# Altium schematic sheet Display.SchDoc: Display
size A4; DrawnBy: Mauro De Bruyn; Revision: 1; SheetNumber: 1; SheetTotal: 5; Sheet 1: 1; Sheet of: 4; Number: PXL Project soldeerbout
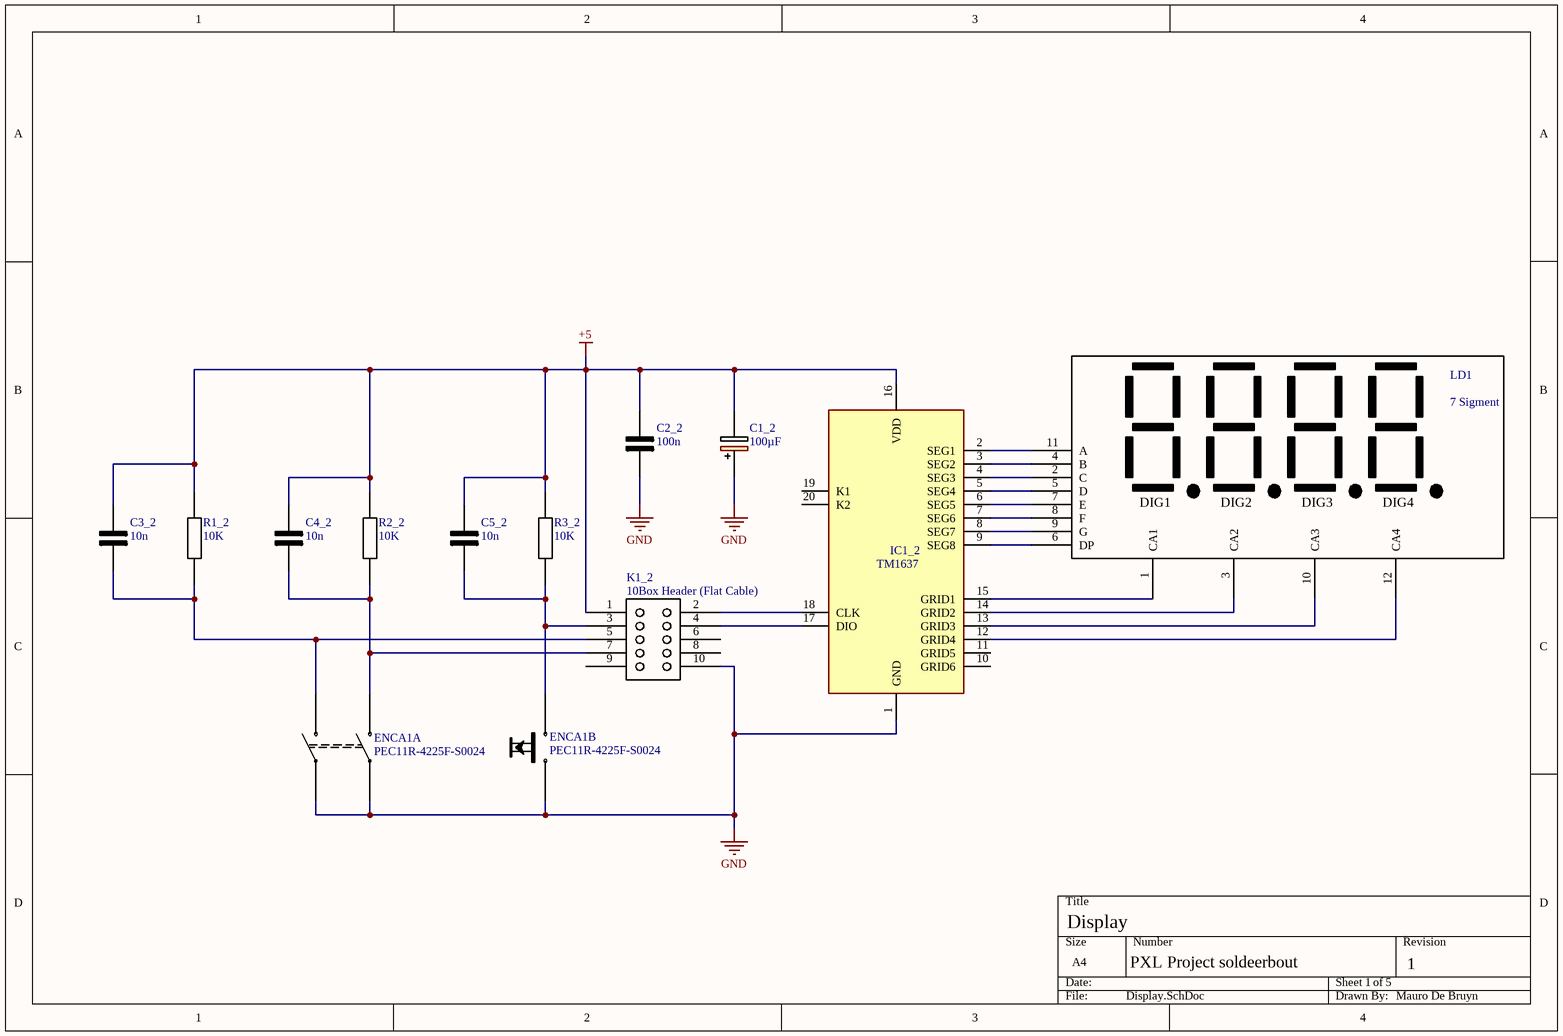
[diagram p0: Display.SchDoc]

## Parts
C1_2  100µF  [CAPPRD350W60D825H1300]
C2_2  100n  [C0805]
C3_2  10n  [C0805]
C4_2  10n  [C0805]
C5_2  10n  [C0805]
ENCA1  PEC11R-4225F-S0024  [PEC12R-4XXXF-SXXXX_1]  (parts A,B of 2)
IC1_2  TM1637  [tm1637]
K1_2  10Box Header (Flat Cable)  [10BoxHeader]
LD1  7 Sigment  [7-Sigment]
R1_2  10K  [C0805]
R2_2  10K  [C0805]
R3_2  10K  [C0805]

## Nets
+5: C1_2.2(-) C2_2.2(-) C3_2.2(-) C4_2.2(-) C5_2.2(-) IC1_2.16(VDD) K1_2.1 R1_2.2 R2_2.2 R3_2.2
GND: C1_2.1(+) C2_2.1(+) ENCA1.2 ENCA1.4 ENCA1.6 IC1_2.1(GND) K1_2.10
NetC3_2_1: C3_2.1(+) ENCA1.1 K1_2.5 R1_2.1
NetC4_2_1: C4_2.1(+) ENCA1.3 K1_2.7 R2_2.1
NetC5_2_1: C5_2.1(+) ENCA1.5 K1_2.3 R3_2.1
NetIC1_2_2: IC1_2.2(SEG1) LD1.11(A)
NetIC1_2_3: IC1_2.3(SEG2) LD1.4(B)
NetIC1_2_4: IC1_2.4(SEG3) LD1.2(C)
NetIC1_2_5: IC1_2.5(SEG4) LD1.5(D)
NetIC1_2_6: IC1_2.6(SEG5) LD1.7(E)
NetIC1_2_7: IC1_2.7(SEG6) LD1.8(F)
NetIC1_2_8: IC1_2.8(SEG7) LD1.9(G)
NetIC1_2_9: IC1_2.9(SEG8) LD1.6(DP)
NetIC1_2_12: IC1_2.12(GRID4) LD1.12(CA4)
NetIC1_2_13: IC1_2.13(GRID3) LD1.10(CA3)
NetIC1_2_14: IC1_2.14(GRID2) LD1.3(CA2)
NetIC1_2_15: IC1_2.15(GRID1) LD1.1(CA1)
NetIC1_2_17: IC1_2.17(DIO) K1_2.4
NetIC1_2_18: IC1_2.18(CLK) K1_2.2

Not connected (* = marked no-connect by the designer): IC1_2 10(GRID6) 11(GRID5) 19(K1) 20(K2); K1_2 6 8 9

## Notes on the sheet
- Display
- (in symbol 7 Sigment) DIG1; DIG2; DIG3; DIG4

## Library data of the parts
C1_2 = RGA101M1HBK-0811G: Capacitor Polarised; Manufacturer_Name: Lelon; Datasheet Link: https://www.arrow.com/en/products/rga101m1hbk-0811g/lelon-electronics; Height: 13mm; Manufacturer_Part_Number: RGA101M1HBK-0811G
C2_2 C3_2 C4_2 C5_2 = 0805_1: Capacitor; Manufacturer_Name: Kemet; Manufacturer_Part_Number: C0805C391G3GACTU; Datasheet Link: https://content.kemet.com/datasheets/KEM_C1003_C0G_SMD.pdf; Height: 1.1mm
ENCA1 = PEC11R-4225F-S0024: Undefined or Miscellaneous; Manufacturer_Name: Bourns; Datasheet Link: https://componentsearchengine.com//PEC11R-4225F-S0024.pdf; Mouser2 Part Number: 652-PEC11R-4225F-S24; Mouser2 Price/Stock: https://www.mouser.com/Search/Refine.aspx?Keyword=652-PEC11R-4225F-S24; Manufacturer_Part_Number: PEC11R-4225F-S0024
IC1_2 = TM1637__SOP_: Integrated Circuit; Manufacturer_Name: TITAN MICRO ELECTRONICS; Manufacturer_Part_Number: TM1637 (SOP); Datasheet Link: https://www.mcielectronics.cl/website_MCI/static/documents/Datasheet_TM1637.pdf; Height: 2.8mm
R1_2 R2_2 R3_2 = 0805: Resistor; Manufacturer_Name: Kemet; Manufacturer_Part_Number: C0805C391G3GACTU; Datasheet Link: https://content.kemet.com/datasheets/KEM_C1003_C0G_SMD.pdf; Height: 1.1mm